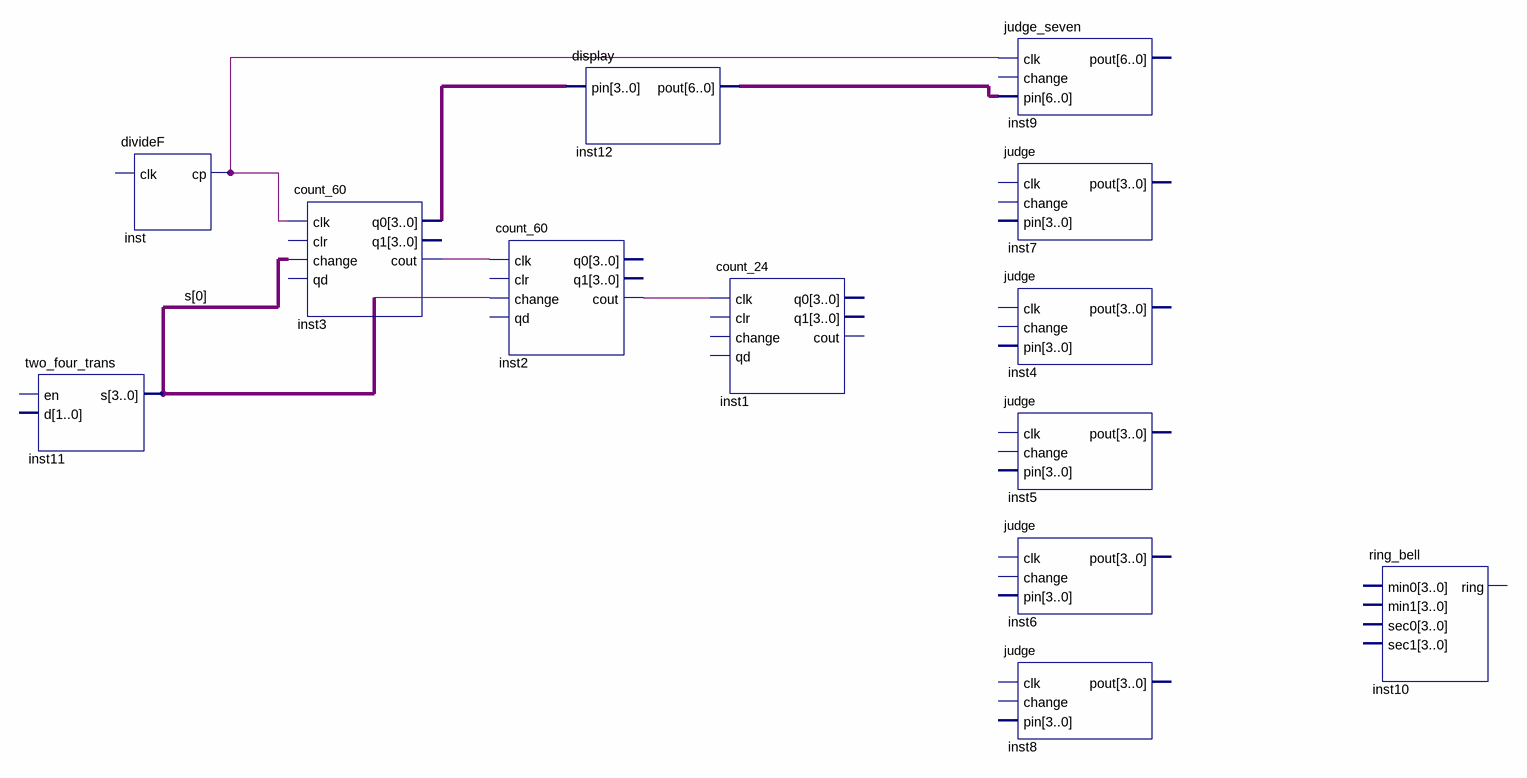
[diagram p0: schematic sheet]
// Quartus schematic clock.bdf as structural Verilog: 13 symbols, 0 pins
module clock (
);

  wire inst2_cout, inst3_cout, inst_cp;
  wire [0:0] s;
  wire [3:0] inst3_q0;
  wire [6:0] inst12_pout;

  two_four_trans inst11 (.s(s[0]));  // open: en, d
  divideF inst (.cp(inst_cp));  // open: clk
  count_60 inst3 (.clk(inst_cp), .change(s[0]), .q0(inst3_q0), .cout(inst3_cout));  // open: clr, qd, q1
  count_60 inst2 (.clk(inst3_cout), .change(s[0]), .cout(inst2_cout));  // open: clr, qd, q0, q1
  display inst12 (.pin(inst3_q0), .pout(inst12_pout));
  count_24 inst1 (.clk(inst2_cout));  // open: clr, change, qd, q0, q1, cout
  judge_seven inst9 (.clk(inst_cp), .pin(inst12_pout));  // open: change, pout
  judge inst7 ();  // open: clk, change, pin, pout
  judge inst4 ();  // open: clk, change, pin, pout
  judge inst5 ();  // open: clk, change, pin, pout
  judge inst6 ();  // open: clk, change, pin, pout
  judge inst8 ();  // open: clk, change, pin, pout
  ring_bell inst10 ();  // open: min0, min1, sec0, sec1, ring
endmodule
